# Altium schematic sheet DAU_Kupplung_1_phasig_V1_16.SchDoc: DAU_Kupplung_1_phasig_V1_16.sch
size 410 x 286 mm; Date: 24.10.2014 08:37:23; DocumentNumber: Document Number:; Revision: REV:; SheetNumber: 1
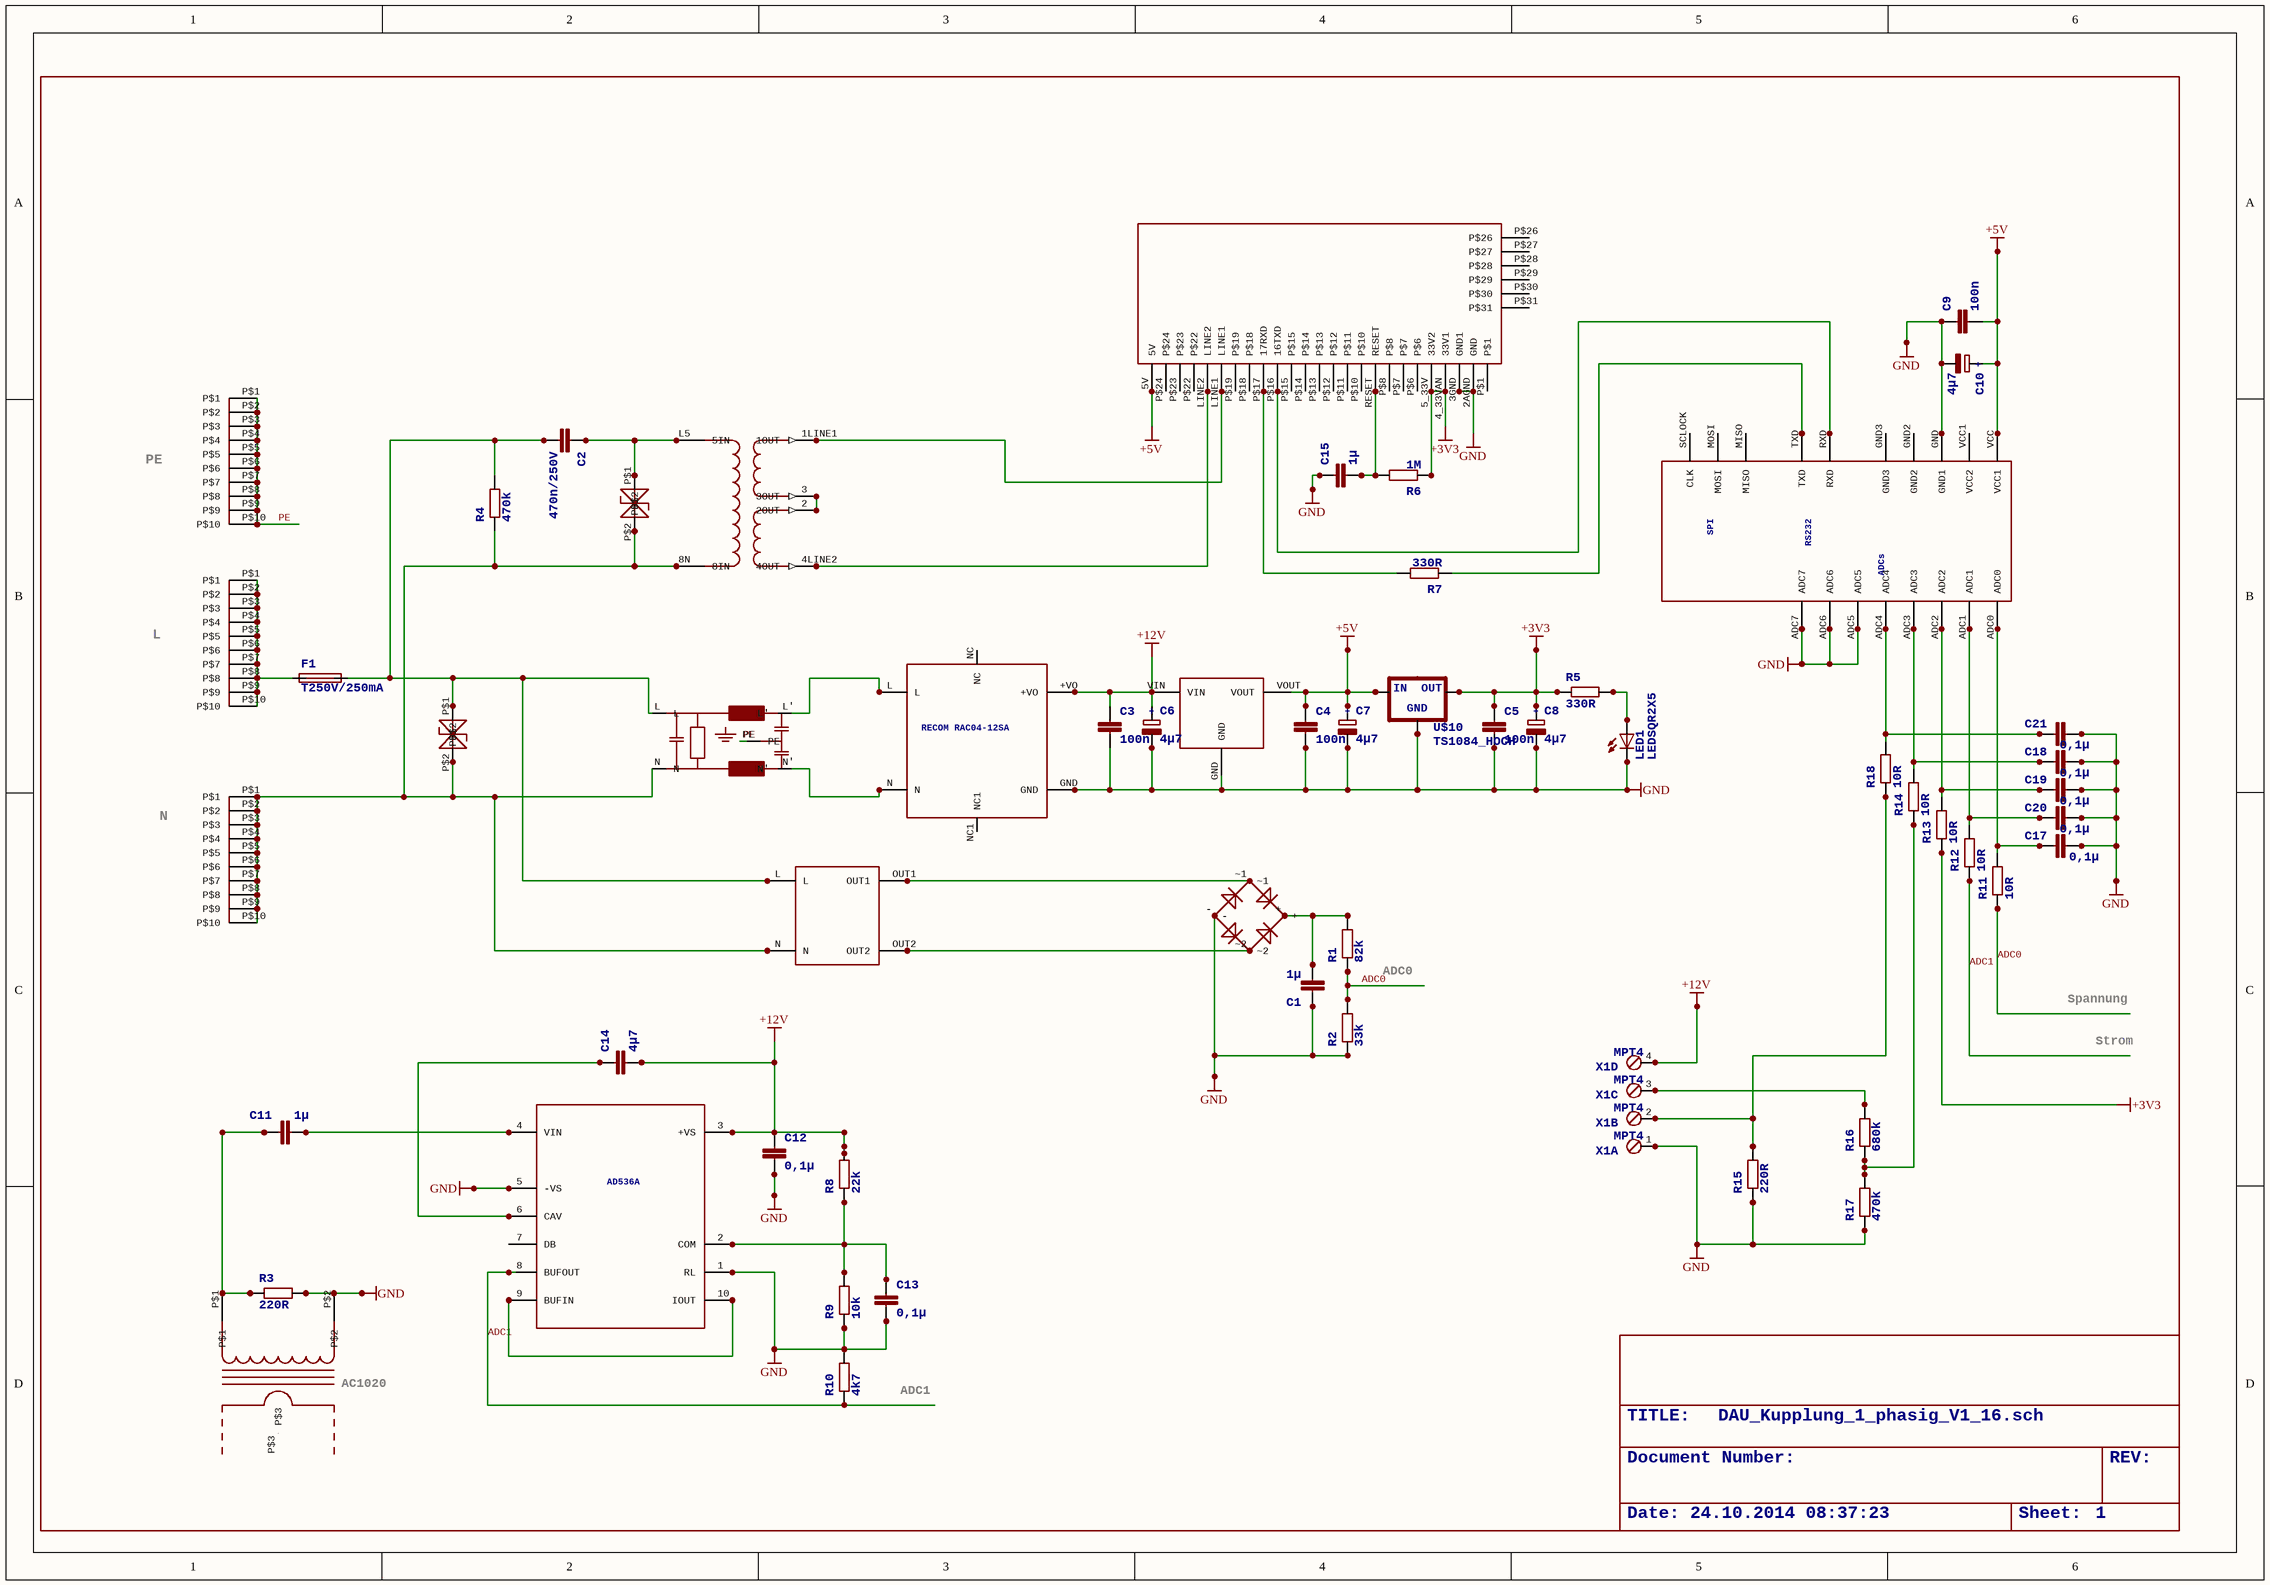
[diagram p0: DAU_Kupplung_1_phasig_V1_16.SchDoc]

## Parts
AC1020  AC1010  [AC1010]  (value not drawn)
C1  1µ  [C2.5-3]
C2  470n/250V  [C150-072X183]
C3  100n  [C0805]
C4  100n  [C0805]
C5  100n  [C0805]
C6  4µ7  [E2-4]
C7  4µ7  [E2-4]
C8  4µ7  [E2-4]
C9  100n  [C0805]
C10  4µ7  [E2-4]
C11  1µ  [C0805]
C12  0,1µ  [C0805]
C13  0,1µ  [C0805]
C14  4µ7  [C0805]
C15  1µ  [C0805]
C17  0,1µ  [C0805]
C18  0,1µ  [C0805]
C19  0,1µ  [C0805]
C20  0,1µ  [C0805]
C21  0,1µ  [C0805]
F1  T250V/250mA  [TR5]
L  PRINT_CONNECTOR  [FASTON_DOUBLE]  (value not drawn)
LED1  LEDSQR2X5  [LED2X5]
N  PRINT_CONNECTOR  [FASTON_DOUBLE]  (value not drawn)
PE  PRINT_CONNECTOR  [FASTON_DOUBLE]  (value not drawn)
R1  82k  [R1206]
R2  33k  [R1206]
R3  220R  [R1206]
R4  470k  [0204/7]
R5  330R  [R1206]
R6  1M  [R1206]
R7  330R  [R1206]
R8  22k  [R1206]
R9  10k  [R1206]
R10  4k7  [R1206]
R11  10R  [R1206]
R12  10R  [R1206]
R13  10R  [R1206]
R14  10R  [R1206]
R15  220R  [R1206]
R16  680k  [R1206]
R17  470k  [R1206]
R18  10R  [R1206]
U$1  RECOM_RAC04_12SA  [RAC04_12SA]  (value not drawn)
U$2  SICHERHEITSTRAFO  [TRAFO_0,35VA]  (value not drawn)
U$3  ADUC831_MINIMUM  [ADUC_MINIMUM]  (value not drawn)
U$4  IT800  [IT800]  (value not drawn)
U$5  PLC_UEBERTRAGER_V2  [PLC-UEBERTRAGER_V2]  (value not drawn)
U$6  NETZFILTER_05_A  [NETZFILTER]  (value not drawn)
U$7  AD536  [TO100_10PIN]  (value not drawn)
U$8  RECTIFIER  [RECTIFIER]  (value not drawn)
U$9  TSV  [TSV]  (value not drawn)
U$10  TS1084_HOCH  [TS1084_HOCH]
U$11  RECOM_785_05  [RECOM785X]  (value not drawn)
U$12  TSV  [TSV]  (value not drawn)
X1  MPT4  [4POL254]  (parts A,B,C,D of 4)

## Nets
+3V3: C5.1 C8.+ R5.1 R6.1 R13.1 U$4.4_33VAN(33V1) U$4.5_33V(33V2) U$10.OUT
+5V: C4.1 C7.+ C9.2 C10.+ U$3.VCC(VCC1) U$4.5V U$10.IN U$11.VOUT
+12V: C3.1 C6.+ C12.1 C14.2 R8.2 U$1.+VO U$7.3(+VS) U$11.VIN X1.4
GND: AC1020.P$2 C1.1 C3.2 C4.2 C5.2 C6.- C7.- C8.- C9.1 C10.- C12.2 C13.2 C15.1 C17.2 C18.2 C19.2 C20.2 C21.2 LED1.K(C) R2.1 R3.2 R9.1 R10.2 R15.1 R17.1 U$1.GND U$3.ADC5 U$3.ADC6 U$3.ADC7 U$3.GND(GND1) U$4.2AGND(GND) U$4.3GND(GND1) U$7.1(RL) U$7.5(-VS) U$8.- U$10.GND U$11.GND X1.1
ADC0: R1.1 R2.2 R11.1
ADC1: R10.1 R12.1 U$7.8(BUFOUT)
PE: PE.P$1 PE.P$2 PE.P$3 PE.P$4 PE.P$5 PE.P$6 PE.P$7 PE.P$8 PE.P$9 PE.P$10 U$6.PE
NetAC1020_P$1: AC1020.P$1 C11.1 R3.1
NetC1_2: C1.2 R1.2 U$8.+
NetC2_1: C2.1 U$5.L5(5IN) U$12.P$1
NetC2_2: C2.2 F1.2 R4.2 U$2.L U$6.L U$9.P$1
NetC11_2: C11.2 U$7.4(VIN)
NetC13_1: C13.1 R8.1 R9.2 U$7.2(COM)
NetC14_1: C14.1 U$7.6(CAV)
NetC15_2: C15.2 R6.2 U$4.RESET
NetC17_1: C17.1 R11.2 U$3.ADC0
NetC18_1: C18.1 R14.2 U$3.ADC3
NetC19_1: C19.1 R13.2 U$3.ADC2
NetC20_1: C20.1 R12.2 U$3.ADC1
NetC21_1: C21.1 R18.2 U$3.ADC4
NetF1_1: F1.1 L.P$1 L.P$2 L.P$3 L.P$4 L.P$5 L.P$6 L.P$7 L.P$8 L.P$9 L.P$10
NetLED1_A: LED1.A R5.2
NetN_P$1: N.P$1 N.P$2 N.P$3 N.P$4 N.P$5 N.P$6 N.P$7 N.P$8 N.P$9 N.P$10 R4.1 U$2.N U$5.8N(8IN) U$6.N U$9.P$2 U$12.P$2
NetR7_1: R7.1 U$3.TXD
NetR7_2: R7.2 U$4.P$17(17RXD)
NetR14_1: R14.1 R16.1 R17.2
NetR15_2: R15.2 R18.1 X1.2
NetR16_2: R16.2 X1.3
NetU$1_L: U$1.L U$6.L'
NetU$1_N: U$1.N U$6.N'
NetU$2_OUT1: U$2.OUT1 U$8.~1
NetU$2_OUT2: U$2.OUT2 U$8.~2
NetU$3_RXD: U$3.RXD U$4.P$16(16TXD)
NetU$4_LINE1: U$4.LINE1 U$5.1LINE1(1OUT)
NetU$4_LINE2: U$4.LINE2 U$5.4LINE2(4OUT)
NetU$5_2: U$5.2(2OUT) U$5.3(3OUT)
NetU$7_9: U$7.9(BUFIN) U$7.10(IOUT)

Not connected (* = marked no-connect by the designer): AC1020 P$3; U$1 NC NC1; U$3 GND2 GND3 MISO MOSI SCLOCK(CLK) VCC1(VCC2); U$4 P$1 P$6 P$7 P$8 P$10 P$11 P$12 P$13 P$14 P$15 P$18 P$19 P$22 P$23 P$24 P$26 P$27 P$28 P$29 P$30 P$31; U$7 7(DB)

## Notes on the sheet
- PE
- L
- N
- ADC0
- Spannung
- Strom
- (near AC1020) AC1020
- ADC1

## Library data of the parts
C1 = C2,5-3: <B>CAPACITOR</B><p> / naming: grid - package width
C2 = C-EU150-072X183: <B>CAPACITOR</B>, European symbol
C3-C5 C9 C11-C15 C17-C21 = C-EUC0805: <B>CAPACITOR</B>, European symbol
C6-C8 C10 = CPOL-EUE2-4: <B>POLARIZED CAPACITOR</B>, European symbol; +: +
F1 = TR5: <b>FUSE</b><p> / Wickmann; OC_FARNELL: unknown; OC_NEWARK: unknown
LED1 = LEDSQR2X5: <b>LED</b><p> / <u>OSRAM</u>:<br> / - <u>CHIPLED</u><br> / LG R971, LG N971, LY N971, LG Q971, LY Q971, LO R971, LY R971 / LH N974, LH R974<br> / LS Q976, LO Q976, LY Q976<br> / LO Q996<br> / - <u>Hyper CHIPLED</u><br> / LW Q18S<br> / LB Q993, LB Q99A, LB R99A<br> / - <u>SideLED</u><br> / LS A670, LO A670, LY A670, LG A670, LP A670<br> / LB A673, LV A673, LT A673, LW A673<br> / LH A674<br> / LY A675<br> / LS A676, LA A676, LO A676, LY A676, LW A676<br> / LS A679, LY A679, LG A679<br> / -  <u>Hyper Micro SIDELED®</u><br> / LS Y876, LA Y876, LO Y876, LY Y876<br> / LT Y87S<br> / - <u>SmartLED</u><br> / LW L88C, LW L88S<br> / LB L89C, LB L89S, LG L890<br> / LS L89K, LO L89K, LY L89K<br> / LS L896, LA L896, LO L896, LY L896<br> / - <u>TOPLED</u><br> / LS T670, LO T670, LY T670, LG T670, LP T670<br> / LSG T670, LSP T670, LSY T670, LOP T670, LYG T670<br> / LG T671, LOG T671, LSG T671<br> / LB T673, LV T673, LT T673, LW T673<br> / LH T674<br> / LS T676, LA T676, LO T676, LY T676, LB T676, LH T676, LSB T676, LW T676<br> / LB T67C, LV T67C, LT T67C, LS T67K, LO T67K, LY T67K, LW E67C<br> / LS E67B, LA E67B, LO E67B, LY E67B, LB E67C, LV E67C, LT E67C<br> / LW T67C<br> / LS T679, LY T679, LG T679<br> / LS T770, LO T770, LY T770, LG T770, LP T770<br> / LB T773, LV T773, LT T773, LW T773<br> / LH T774<br> / LS E675, LA E675, LY E675, LS T675<br> / LS T776, LA T776, LO T776, LY T776, LB T776<br> / LHGB T686<br> / LT T68C, LB T68C<br> / - <u>Hyper Mini TOPLED®</u><br> / LB M676<br> / - <u>Mini TOPLED Santana®</u><br> / LG M470<br> / LS M47K, LO M47K, LY M47K / <p> / Source: http://www.osram.convergy.de<p> / <u>LUXEON:</u><br> / - <u>LUMILED®</u><br> / LXK2-PW12-R00, LXK2-PW12-S00, LXK2-PW14-U00, LXK2-PW14-V00<br> / LXK2-PM12-R00, LXK2-PM12-S00, LXK2-PM14-U00<br> / LXK2-PE12-Q00, LXK2-PE12-R00, LXK2-PE12-S00, LXK2-PE14-T00, LXK2-PE14-U00<br> / LXK2-PB12-K00, LXK2-PB12-L00, LXK2-PB12-M00, LXK2-PB14-N00, LXK2-PB14-P00, LXK2-PB14-Q00<br> / LXK2-PR12-L00, LXK2-PR12-M00, LXK2-PR14-Q00, LXK2-PR14-R00<br> / LXK2-PD12-Q00, LXK2-PD12-R00, LXK2-PD12-S00<br> / LXK2-PH12-R00, LXK2-PH12-S00<br> / LXK2-PL12-P00, LXK2-PL12-Q00, LXK2-PL12-R00 / <p> / Source: www.luxeon.com<p> / <u>KINGBRIGHT:</U><p> / KA-3528ASYC<br> / Source: www.kingbright.com
R1-R3 R5-R18 = R-EU_R1206: <B>RESISTOR</B>, European symbol
R4 = R-EU_0204/7: <B>RESISTOR</B>, European symbol
X1 = MPT4: <b>PHOENIX CONNECTOR</b>; OC_FARNELL: unknown; OC_NEWARK: unknown
U$1 = RECOM_RAC04_12SA: RECOM RAC04-12SA: RECOM RAC04-12SA
U$3 = ADUC831_MINIMUM: SPI: SPI; RS232: RS232; ADCs: ADCs
U$7 = AD536: AD536A: AD536A
U$10 = TS1084_HOCH: GND: GND; IN: IN; OUT: OUT